# Altium schematic sheet sensors.SchDoc
size A; SheetNumber: 4; SheetTotal: 4
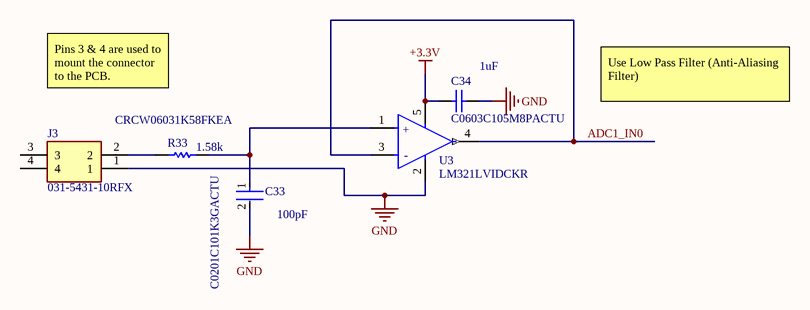
[diagram p0: sensors.SchDoc]

## Parts
C33  C0201C101K3GACTU  [FP-C0201-AB-MFG]
C34  C0603C105M8PACTU  [CAPC1608X90X35LL15T15]
J3  031-5431-10RFX  [031543110RFX]
R33  CRCW06031K58FKEA  [RESC1609X50X30NL10T20]
U3  LM321LVIDCKR  [FP-DCK0005A-IPC_B]

## Nets
+3.3V: C34.2 U3.5(V+)
GND: C33.2 C34.1 J3.1 U3.2(V-)
ADC1_IN0: U3.3(IN-) U3.4(OUT)
NetC33_1: C33.1 R33.2 U3.1(IN+)
NetJ3_2: J3.2 R33.1

Not connected (* = marked no-connect by the designer): J3 3 4

## Notes on the sheet
- (near C34) 1uF
- Pins 3 & 4 are used to mount the connector to the PCB.
- Use Low Pass Filter (Anti-Aliasing Filter)
- (near R33) 1.58k
- (near C33) 100pF
- (in symbol CMP-04895-000147-1) +; -

## Library data of the parts
C33 = CMP-03020-034480-1: CAP CER 100PF 25V 5% NP0 0201; Manufacturer: KEMET; Standoff Height: 0mm; Temperature Coefficient: 30ppm/°C; Tolerance: 0.1; Temperature Characteristic: C0G; Material: Ceramic; Value: 100 pF; Package: C0201-AB; Device Class L1: Passive Components; Device Class L3: Ceramic Capacitors; Automotive: No; Temperature Range Low: -55°C; Temperature Range High: +125°C; Octopart: https://octopart.com/c0201c101k3gactu-kemet-17054818; Ipc Land Pattern Name: CAPC6030X30; ComponentLink2URL: https://content.kemet.com/datasheets/KEM_C1003_C0G_SMD.pdf; Height: 0.33mm; Voltage Rating: 25 V; Lead Free: Yes; ComponentLink2Description: Datasheet; Digikey Description: CAP CER 100PF 25V 5% NP0 0201; Device Class L2: Capacitors; Capacitance: 100 pF; Temperature: -55°C to +125°C; Manufacturer Part Number: C0201C101K3GACTU; Mouser Description: Multilayer Ceramic Capacitors MLCC - SMD/SMT 25volts 100pF C0G 10%; Category: Cap; RoHS: TRUE
C34 = CMP-2006-02271-1: Manufacturer: Kemet; Part Number: C0603C105M8PACTU
J3 = 031-5431-10RFX: Amphenol BNC Series Right Angle 50 Through Hole BNC Connector, jack, Nickel, Solder Termination; Geometry.Height: 15.6mm; Mouser Part Number: 523-31-5431-10RFX; Mouser Price/Stock: https://www.mouser.co.uk/ProductDetail/Amphenol-RF/031-5431-10RFX?qs=py4qCovljJ8doXL0muNs1w%3D%3D; Manufacturer_Name: Amphenol; Manufacturer_Part_Number: 031-5431-10RFX; Datasheet Link: https://datasheet.datasheetarchive.com/originals/distributors/Datasheets-DGA15/760686.pdf
R33 = CMP-2000-02999-1: Manufacturer: Vishay Dale; Part Number: CRCW06031K58FKEA
U3 = CMP-04895-000147-1: IC OPAMP GP 1 CIRCUIT SC70-5; RoHS Compliant: Yes